# Altium schematic sheet Sheet2.SchDoc
size A4
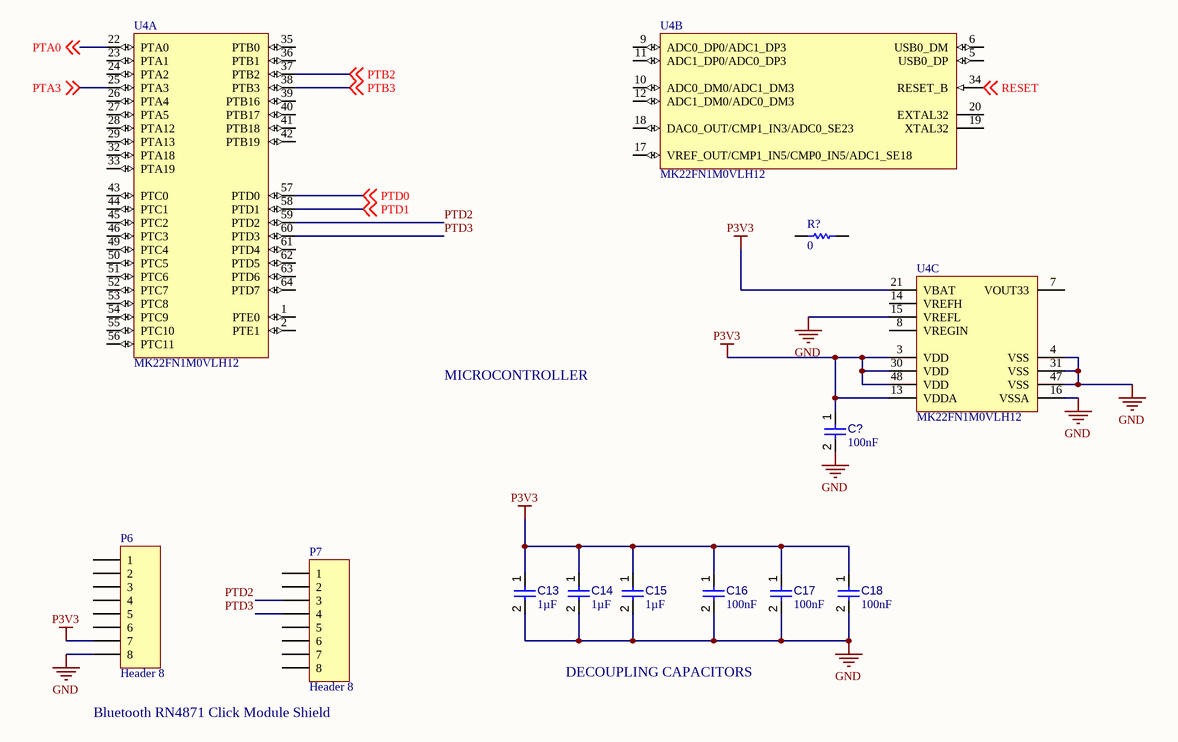
[diagram p0: Sheet2.SchDoc]

## Parts
C13  value 1µF  [CAPC0603(1608)100_L]  (hidden comment: Capacitor 1µF +/-40% 50V 0603)
C14  value 1µF  [CAPC0603(1608)100_L]  (hidden comment: Capacitor 1µF +/-40% 50V 0603)
C15  value 1µF  [CAPC0603(1608)100_L]  (hidden comment: Capacitor 1µF +/-40% 50V 0603)
C16  value 100nF  [CAPC0402(1005)60_L]  (hidden comment: Capacitor 100nF +/-20% 50V 0402)
C17  value 100nF  [CAPC0402(1005)60_L]  (hidden comment: Capacitor 100nF +/-20% 50V 0402)
C18  value 100nF  [CAPC0402(1005)60_L]  (hidden comment: Capacitor 100nF +/-20% 50V 0402)
C?  value 100nF  [CAPC1608X90X40ML10T20]  (hidden comment: Capacitor 100 nF +/-10% 50 V 0603)
P6  Header 8  [HDR1X8]
P7  Header 8  [HDR1X8]
R?  value 0  [RESC1005X40X25ML05T05]  (hidden comment: Resistor 0R +/- 5% 0402 100 mW)
U4  MK22FN1M0VLH12  [FREE-LQFP-64_M]  (parts A,B,C of 3)

## Nets
GND: C13.2 C14.2 C15.2 C16.2 C17.2 C18.2 C?.2 P6.8 U4.4(VSS) U4.15(VREFL) U4.16(VSSA) U4.31(VSS) U4.47(VSS)
P3V3: C13.1 C14.1 C15.1 C16.1 C17.1 C18.1 C?.1 P6.7 U4.3(VDD) U4.13(VDDA) U4.21(VBAT) U4.30(VDD) U4.48(VDD)
PTA0: U4.22(PTA0) ; off-sheet PTA0
PTA3: U4.25(PTA3) ; off-sheet PTA3
PTB2: U4.37(PTB2) ; off-sheet PTB2
PTB3: U4.38(PTB3) ; off-sheet PTB3
PTD0: U4.57(PTD0) ; off-sheet PTD0
PTD1: U4.58(PTD1) ; off-sheet PTD1
PTD2: P7.3 U4.59(PTD2)
PTD3: P7.4 U4.60(PTD3)
RESET: U4.34(RESET_B) ; off-sheet RESET

Not connected (* = marked no-connect by the designer): P6 1 2 3 4 5 6; P7 1 2 5 6 7 8; R? 1 2; U4 1(PTE0) 2(PTE1) 5(USB0_DP) 6(USB0_DM) 7(VOUT33) 8(VREGIN) 9(ADC0_DP0/ADC1_DP3) 10(ADC0_DM0/ADC1_DM3) 11(ADC1_DP0/ADC0_DP3) 12(ADC1_DM0/ADC0_DM3) 14(VREFH) 17(VREF_OUT/CMP1_IN5/CMP0_IN5/ADC1_SE18) 18(DAC0_OUT/CMP1_IN3/ADC0_SE23) 19(XTAL32) 20(EXTAL32) 23(PTA1) 24(PTA2) 26(PTA4) 27(PTA5) 28(PTA12) 29(PTA13) 32(PTA18) 33(PTA19) 35(PTB0) 36(PTB1) 39(PTB16) 40(PTB17) 41(PTB18) 42(PTB19) 43(PTC0) 44(PTC1) 45(PTC2) 46(PTC3) 49(PTC4) 50(PTC5) 51(PTC6) 52(PTC7) 53(PTC8) 54(PTC9) 55(PTC10) 56(PTC11) 61(PTD4) 62(PTD5) 63(PTD6) 64(PTD7)

## Notes on the sheet
- MICROCONTROLLER
- Bluetooth RN4871 Click Module Shield
- DECOUPLING CAPACITORS

## Library data of the parts
C13-C15 = CMP-001-00078-2: Chip Capacitor, 1µF +/-40%, 50V, 0603, Thickness 1 mm; Tolerance: 10%; Max Operating Temperature: 85°C; Voltage Rating: 50V; Pins: 2; Case/Package: 0402; Mounting Technology: SMT; Min Operating Temperature: -55°C
C16-C18 = CMP-001-00067-2: Chip Capacitor, 100nF +/-20%, 50V, 0402, Thickness 0.6 mm; Tolerance: 10%; Mounting Technology: SMT; Min Operating Temperature: -55°C; Pins: 2; Case/Package: 0402; Voltage Rating: 50V; Max Operating Temperature: 85°C
C? = CMP-001-00017-4: Chip Capacitor, 100 nF, +/- 10%, 50 V, 0603 (1608 Metric); Capacitor Type: Ceramic; Voltage Rating: 50V; RoHS Compliant: True; Max Operating Temperature: 125°C; Pins: 2; Mounting Technology: SM; Min Operating Temperature: -55°C; Tolerance: 10%; Case/Package: 0603
P6 P7 = Header 8: Header, 8-Pin; LatestRevisionDate: 17-Jul-2002; LatestRevisionNote: Re-released for DXP Platform.; Publisher: Altium Limited
R? = CMP-009-00005-4: Chip Resistor, 0 Ohm, 0.1 W, -55 to 155 degC, 0402 (1005 Metric); Voltage Rating: 50V; Power: 100mW; Max Operating Temperature: 155°C; Tolerance: 5%; RoHS Compliant: True; Pins: 2; Case/Package: 0402; Min Operating Temperature: -55°C; Mounting Technology: SM
U4 = CMP-020-00010-2: Kinetis K22F Sub-Family, 120 MHz ARM(R) Cortex(R)-M4-based Microcontroller with FPU, 1.71 to 3.6 V, -40 to 105 degC, 64-Pin LQFP, RoHS, Tray; Manufacturer: Freescale; Min Supply Voltage: 1.71V; Interface: UART; Density: 1MB; RAM Size: 128KB; Max Supply Voltage: 3.6V; Max Clock Frequency: 120MHz; Package Version: Rev. G, 01/2016; Manufacturer URL: http://www.nxp.com/; Packaging: Tray; RoHS Compliant: True; Pins: 64; Case/Package: LQFP; Package URL: http://cache.nxp.com/files/shared/doc/package_info/98ASS23234W.pdf?fsrch=1&sr=1&pageNum=1; Datasheet URL: http://cache.nxp.com/files/32bit/doc/data_sheet/K22P64M120SF5.pdf; Package Quantity: 160; Package Description: 64-Pin Low-profile Quad Flat Package, Body 10 x 10 mm, Pitch 0.5 mm; Mounting Technology: SM; Max Operating Temperature: 105°C; Package Reference: LQFP-64; Min Operating Temperature: -40°C; Datasheet Version: Rev. 4, 11/2014